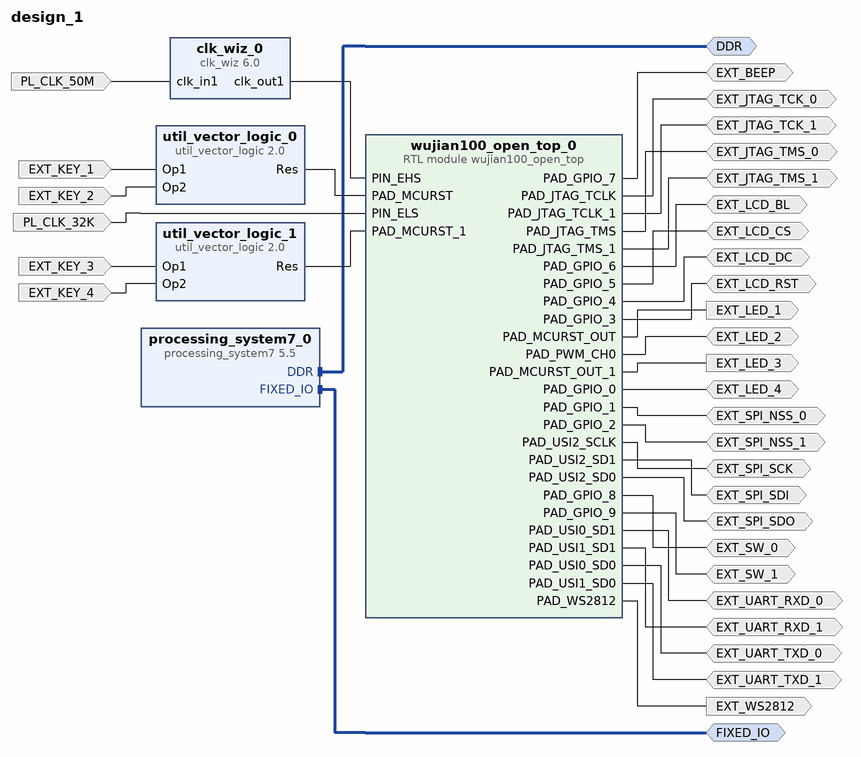
[diagram p0: block diagram of the top level]
# Vivado block design design_1, xc7z020clg400-3, Vivado 2023.1.1
create_bd_design design_1

create_bd_intf_port -mode Master -vlnv xilinx.com:interface:ddrx_rtl:1.0 DDR
create_bd_intf_port -mode Master -vlnv xilinx.com:display_processing_system7:fixedio_rtl:1.0 FIXED_IO
create_bd_port -dir I -type clk PL_CLK_50M
set_property -dict {CONFIG.FREQ_HZ 50000000} [get_bd_ports PL_CLK_50M]
create_bd_port -dir I EXT_KEY_1
create_bd_port -dir I EXT_KEY_2
create_bd_port -dir IO EXT_JTAG_TCK_0
create_bd_port -dir IO EXT_JTAG_TMS_0
create_bd_port -dir IO EXT_JTAG_TCK_1
create_bd_port -dir IO EXT_JTAG_TMS_1
create_bd_port -dir IO EXT_SPI_NSS_0
create_bd_port -dir IO EXT_SPI_SCK
create_bd_port -dir IO EXT_SPI_SDO
create_bd_port -dir IO EXT_SPI_SDI
create_bd_port -dir IO EXT_UART_TXD_0
create_bd_port -dir IO EXT_UART_RXD_0
create_bd_port -dir IO EXT_UART_TXD_1
create_bd_port -dir IO EXT_UART_RXD_1
create_bd_port -dir IO EXT_LED_2
create_bd_port -dir IO EXT_LED_4
create_bd_port -dir I -type clk PL_CLK_32K
set_property -dict {CONFIG.FREQ_HZ 32768} [get_bd_ports PL_CLK_32K]
create_bd_port -dir O EXT_LED_1
create_bd_port -dir O EXT_LED_3
create_bd_port -dir I EXT_KEY_3
create_bd_port -dir I EXT_KEY_4
create_bd_port -dir IO EXT_SPI_NSS_1
create_bd_port -dir IO EXT_BEEP
create_bd_port -dir IO EXT_LCD_BL
create_bd_port -dir IO EXT_LCD_RST
create_bd_port -dir IO EXT_LCD_DC
create_bd_port -dir IO EXT_LCD_CS
create_bd_port -dir O EXT_WS2812
create_bd_port -dir IO EXT_SW_0
create_bd_port -dir IO EXT_SW_1

create_bd_cell -type ip -vlnv xilinx.com:ip:clk_wiz:6.0 clk_wiz_0
set_property -dict [list \
  CONFIG.CLKIN1_JITTER_PS 200.0 \
  CONFIG.CLKOUT1_DRIVES BUFGCE \
  CONFIG.CLKOUT1_JITTER 249.363 \
  CONFIG.CLKOUT1_PHASE_ERROR 164.985 \
  CONFIG.CLKOUT1_REQUESTED_OUT_FREQ 20.000 \
  CONFIG.CLKOUT2_DRIVES BUFGCE \
  CONFIG.CLKOUT2_JITTER 943.481 \
  CONFIG.CLKOUT2_PHASE_ERROR 919.522 \
  CONFIG.CLKOUT2_REQUESTED_OUT_FREQ 100.000 \
  CONFIG.CLKOUT2_USED false \
  CONFIG.CLKOUT3_DRIVES BUFGCE \
  CONFIG.CLKOUT4_DRIVES BUFGCE \
  CONFIG.CLKOUT5_DRIVES BUFGCE \
  CONFIG.CLKOUT6_DRIVES BUFGCE \
  CONFIG.CLKOUT7_DRIVES BUFGCE \
  CONFIG.ENABLE_CLOCK_MONITOR false \
  CONFIG.FEEDBACK_SOURCE FDBK_AUTO \
  CONFIG.MMCM_BANDWIDTH OPTIMIZED \
  CONFIG.MMCM_CLKFBOUT_MULT_F 20.000 \
  CONFIG.MMCM_CLKIN1_PERIOD 20.000 \
  CONFIG.MMCM_CLKIN2_PERIOD 10.0 \
  CONFIG.MMCM_CLKOUT0_DIVIDE_F 50.000 \
  CONFIG.MMCM_CLKOUT1_DIVIDE 1 \
  CONFIG.MMCM_COMPENSATION ZHOLD \
  CONFIG.MMCM_DIVCLK_DIVIDE 1 \
  CONFIG.NUM_OUT_CLKS 1 \
  CONFIG.PRIMITIVE MMCM \
  CONFIG.USE_CLKFB_STOPPED false \
  CONFIG.USE_INCLK_STOPPED false \
  CONFIG.USE_LOCKED false \
  CONFIG.USE_POWER_DOWN false \
  CONFIG.USE_RESET false \
  CONFIG.USE_SAFE_CLOCK_STARTUP true \
] [get_bd_cells clk_wiz_0]
create_bd_cell -type ip -vlnv xilinx.com:ip:processing_system7:5.5 processing_system7_0
set_property -dict [list \
  CONFIG.PCW_APU_PERIPHERAL_FREQMHZ 867 \
  CONFIG.PCW_CPU_CPU_6X4X_MAX_RANGE 867 \
  CONFIG.PCW_ENET0_PERIPHERAL_ENABLE 0 \
  CONFIG.PCW_EN_CLK0_PORT 0 \
  CONFIG.PCW_EN_RST0_PORT 0 \
  CONFIG.PCW_FPGA0_PERIPHERAL_FREQMHZ 50 \
  CONFIG.PCW_FPGA1_PERIPHERAL_FREQMHZ 50 \
  CONFIG.PCW_GPIO_MIO_GPIO_ENABLE 0 \
  CONFIG.PCW_PERIPHERAL_BOARD_PRESET None \
  CONFIG.PCW_PRESET_BANK1_VOLTAGE {LVCMOS 3.3V} \
  CONFIG.PCW_QSPI_GRP_SINGLE_SS_ENABLE 1 \
  CONFIG.PCW_QSPI_GRP_SINGLE_SS_IO {MIO 1 .. 6} \
  CONFIG.PCW_QSPI_PERIPHERAL_ENABLE 1 \
  CONFIG.PCW_QSPI_QSPI_IO {MIO 1 .. 6} \
  CONFIG.PCW_SD0_PERIPHERAL_ENABLE 0 \
  CONFIG.PCW_SINGLE_QSPI_DATA_MODE x4 \
  CONFIG.PCW_UART1_PERIPHERAL_ENABLE 1 \
  CONFIG.PCW_UART1_UART1_IO {MIO 48 .. 49} \
  CONFIG.PCW_UART_PERIPHERAL_FREQMHZ 100 \
  CONFIG.PCW_UIPARAM_DDR_FREQ_MHZ 534 \
  CONFIG.PCW_UIPARAM_DDR_PARTNO {MT41J256M16 RE-125} \
  CONFIG.PCW_USB0_PERIPHERAL_ENABLE 0 \
  CONFIG.PCW_USE_M_AXI_GP0 0 \
  CONFIG.preset None \
] [get_bd_cells processing_system7_0]
# 344 more settings of processing_system7_0 are not shown: defaults, MIO pin electricals, DDR timing, and values the tool derives
create_bd_cell -type ip -vlnv xilinx.com:ip:util_vector_logic:2.0 util_vector_logic_0
set_property -dict {CONFIG.C_SIZE 1} [get_bd_cells util_vector_logic_0]
create_bd_cell -type ip -vlnv xilinx.com:ip:util_vector_logic:2.0 util_vector_logic_1
set_property -dict {CONFIG.C_SIZE 1} [get_bd_cells util_vector_logic_1]
create_bd_cell -type module -reference wujian100_open_top wujian100_open_top_0

# ---- connections ----

connect_bd_intf_net [get_bd_intf_ports DDR] [get_bd_intf_pins processing_system7_0/DDR]
connect_bd_intf_net [get_bd_intf_ports FIXED_IO] [get_bd_intf_pins processing_system7_0/FIXED_IO]
connect_bd_net -net EXT_KEY_1_1 [get_bd_ports EXT_KEY_1] [get_bd_pins util_vector_logic_0/Op1]
connect_bd_net -net EXT_KEY_2_1 [get_bd_ports EXT_KEY_2] [get_bd_pins util_vector_logic_0/Op2]
connect_bd_net -net EXT_KEY_3_1 [get_bd_ports EXT_KEY_3] [get_bd_pins util_vector_logic_1/Op1]
connect_bd_net -net EXT_KEY_4_1 [get_bd_ports EXT_KEY_4] [get_bd_pins util_vector_logic_1/Op2]
connect_bd_net [get_bd_ports EXT_SPI_SCK] [get_bd_pins wujian100_open_top_0/PAD_USI2_SCLK]
connect_bd_net [get_bd_ports EXT_SPI_SDI] [get_bd_pins wujian100_open_top_0/PAD_USI2_SD1]
connect_bd_net [get_bd_ports EXT_SPI_NSS_0] [get_bd_pins wujian100_open_top_0/PAD_GPIO_1]
connect_bd_net [get_bd_ports EXT_SPI_SDO] [get_bd_pins wujian100_open_top_0/PAD_USI2_SD0]
connect_bd_net [get_bd_ports EXT_JTAG_TCK_0] [get_bd_pins wujian100_open_top_0/PAD_JTAG_TCLK]
connect_bd_net [get_bd_ports EXT_JTAG_TMS_0] [get_bd_pins wujian100_open_top_0/PAD_JTAG_TMS]
connect_bd_net [get_bd_ports EXT_UART_TXD_0] [get_bd_pins wujian100_open_top_0/PAD_USI0_SD0]
connect_bd_net [get_bd_ports EXT_UART_TXD_1] [get_bd_pins wujian100_open_top_0/PAD_USI1_SD0]
connect_bd_net [get_bd_ports EXT_UART_RXD_1] [get_bd_pins wujian100_open_top_0/PAD_USI1_SD1]
connect_bd_net [get_bd_ports EXT_UART_RXD_0] [get_bd_pins wujian100_open_top_0/PAD_USI0_SD1]
connect_bd_net [get_bd_ports EXT_LED_4] [get_bd_pins wujian100_open_top_0/PAD_GPIO_0]
connect_bd_net [get_bd_ports EXT_LED_2] [get_bd_pins wujian100_open_top_0/PAD_PWM_CH0]
connect_bd_net [get_bd_ports EXT_JTAG_TCK_1] [get_bd_pins wujian100_open_top_0/PAD_JTAG_TCLK_1]
connect_bd_net [get_bd_ports EXT_JTAG_TMS_1] [get_bd_pins wujian100_open_top_0/PAD_JTAG_TMS_1]
connect_bd_net [get_bd_ports EXT_SPI_NSS_1] [get_bd_pins wujian100_open_top_0/PAD_GPIO_2]
connect_bd_net [get_bd_ports EXT_LCD_BL] [get_bd_pins wujian100_open_top_0/PAD_GPIO_6]
connect_bd_net [get_bd_ports EXT_BEEP] [get_bd_pins wujian100_open_top_0/PAD_GPIO_7]
connect_bd_net [get_bd_ports EXT_LCD_RST] [get_bd_pins wujian100_open_top_0/PAD_GPIO_3]
connect_bd_net [get_bd_ports EXT_LCD_DC] [get_bd_pins wujian100_open_top_0/PAD_GPIO_4]
connect_bd_net [get_bd_ports EXT_LCD_CS] [get_bd_pins wujian100_open_top_0/PAD_GPIO_5]
connect_bd_net [get_bd_ports EXT_SW_0] [get_bd_pins wujian100_open_top_0/PAD_GPIO_8]
connect_bd_net [get_bd_ports EXT_SW_1] [get_bd_pins wujian100_open_top_0/PAD_GPIO_9]
connect_bd_net [get_bd_ports PL_CLK_32K] [get_bd_pins wujian100_open_top_0/PIN_ELS]
connect_bd_net [get_bd_ports PL_CLK_50M] [get_bd_pins clk_wiz_0/clk_in1]
connect_bd_net [get_bd_pins clk_wiz_0/clk_out1] [get_bd_pins wujian100_open_top_0/PIN_EHS]
connect_bd_net [get_bd_pins util_vector_logic_0/Res] [get_bd_pins wujian100_open_top_0/PAD_MCURST]
connect_bd_net [get_bd_pins util_vector_logic_1/Res] [get_bd_pins wujian100_open_top_0/PAD_MCURST_1]
connect_bd_net [get_bd_pins wujian100_open_top_0/PAD_MCURST_OUT] [get_bd_ports EXT_LED_1]
connect_bd_net [get_bd_pins wujian100_open_top_0/PAD_MCURST_OUT_1] [get_bd_ports EXT_LED_3]
connect_bd_net [get_bd_pins wujian100_open_top_0/PAD_WS2812] [get_bd_ports EXT_WS2812]

validate_bd_design
save_bd_design
